# EAGLE schematic protestSignNode (EAGLE 6.6.0)

## Sheet 1 of 3
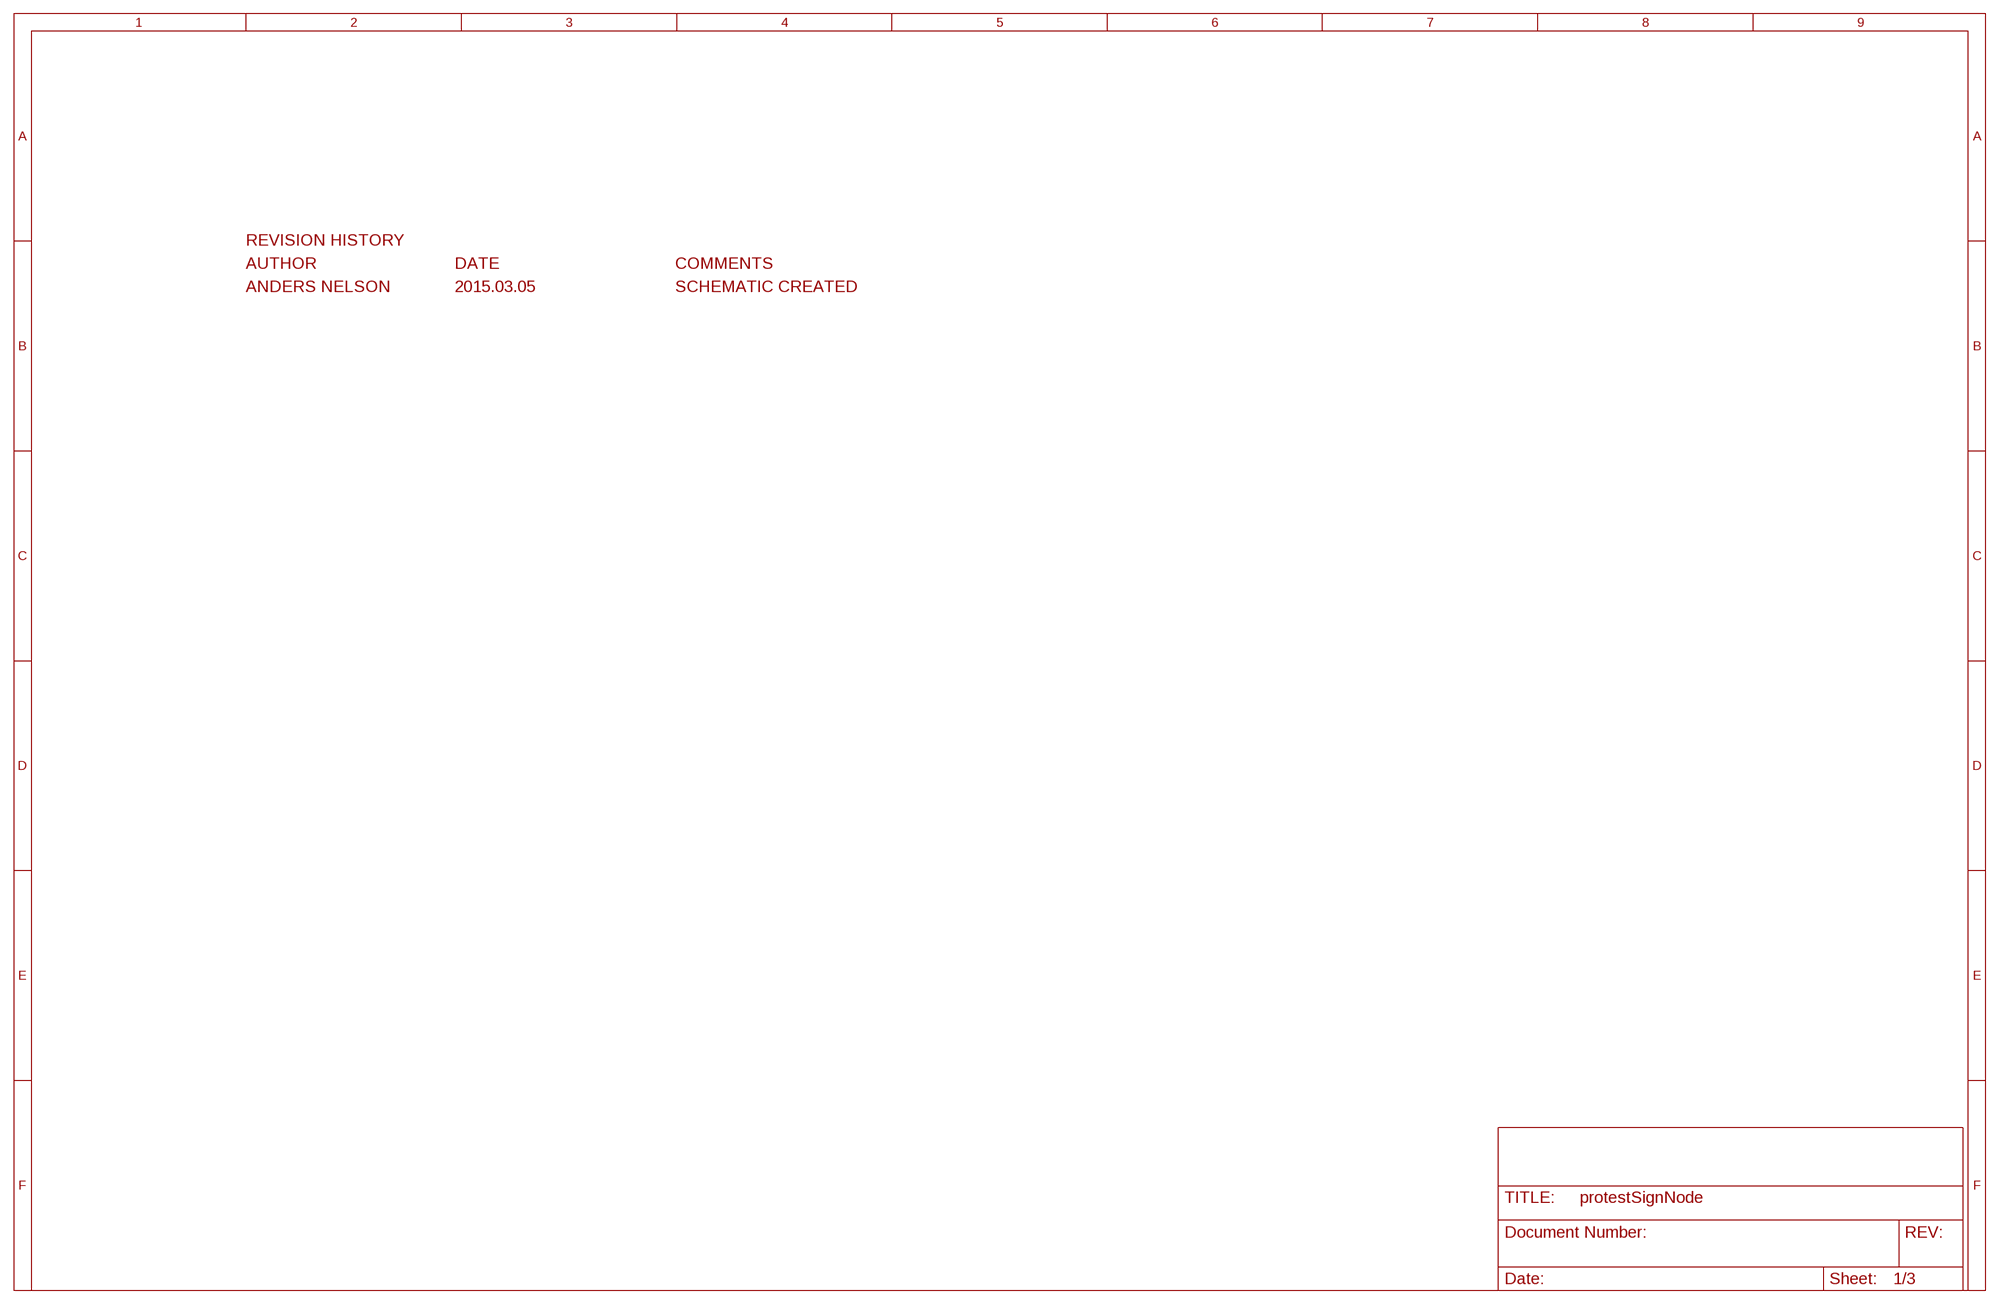
[diagram p0: schematic, sheet 1]

### Notes on the sheet
- REVISION HISTORY
- AUTHOR | DATE | COMMENTS
- ANDERS NELSON | 2015.03.05 | SCHEMATIC CREATED

## Sheet 2 of 3
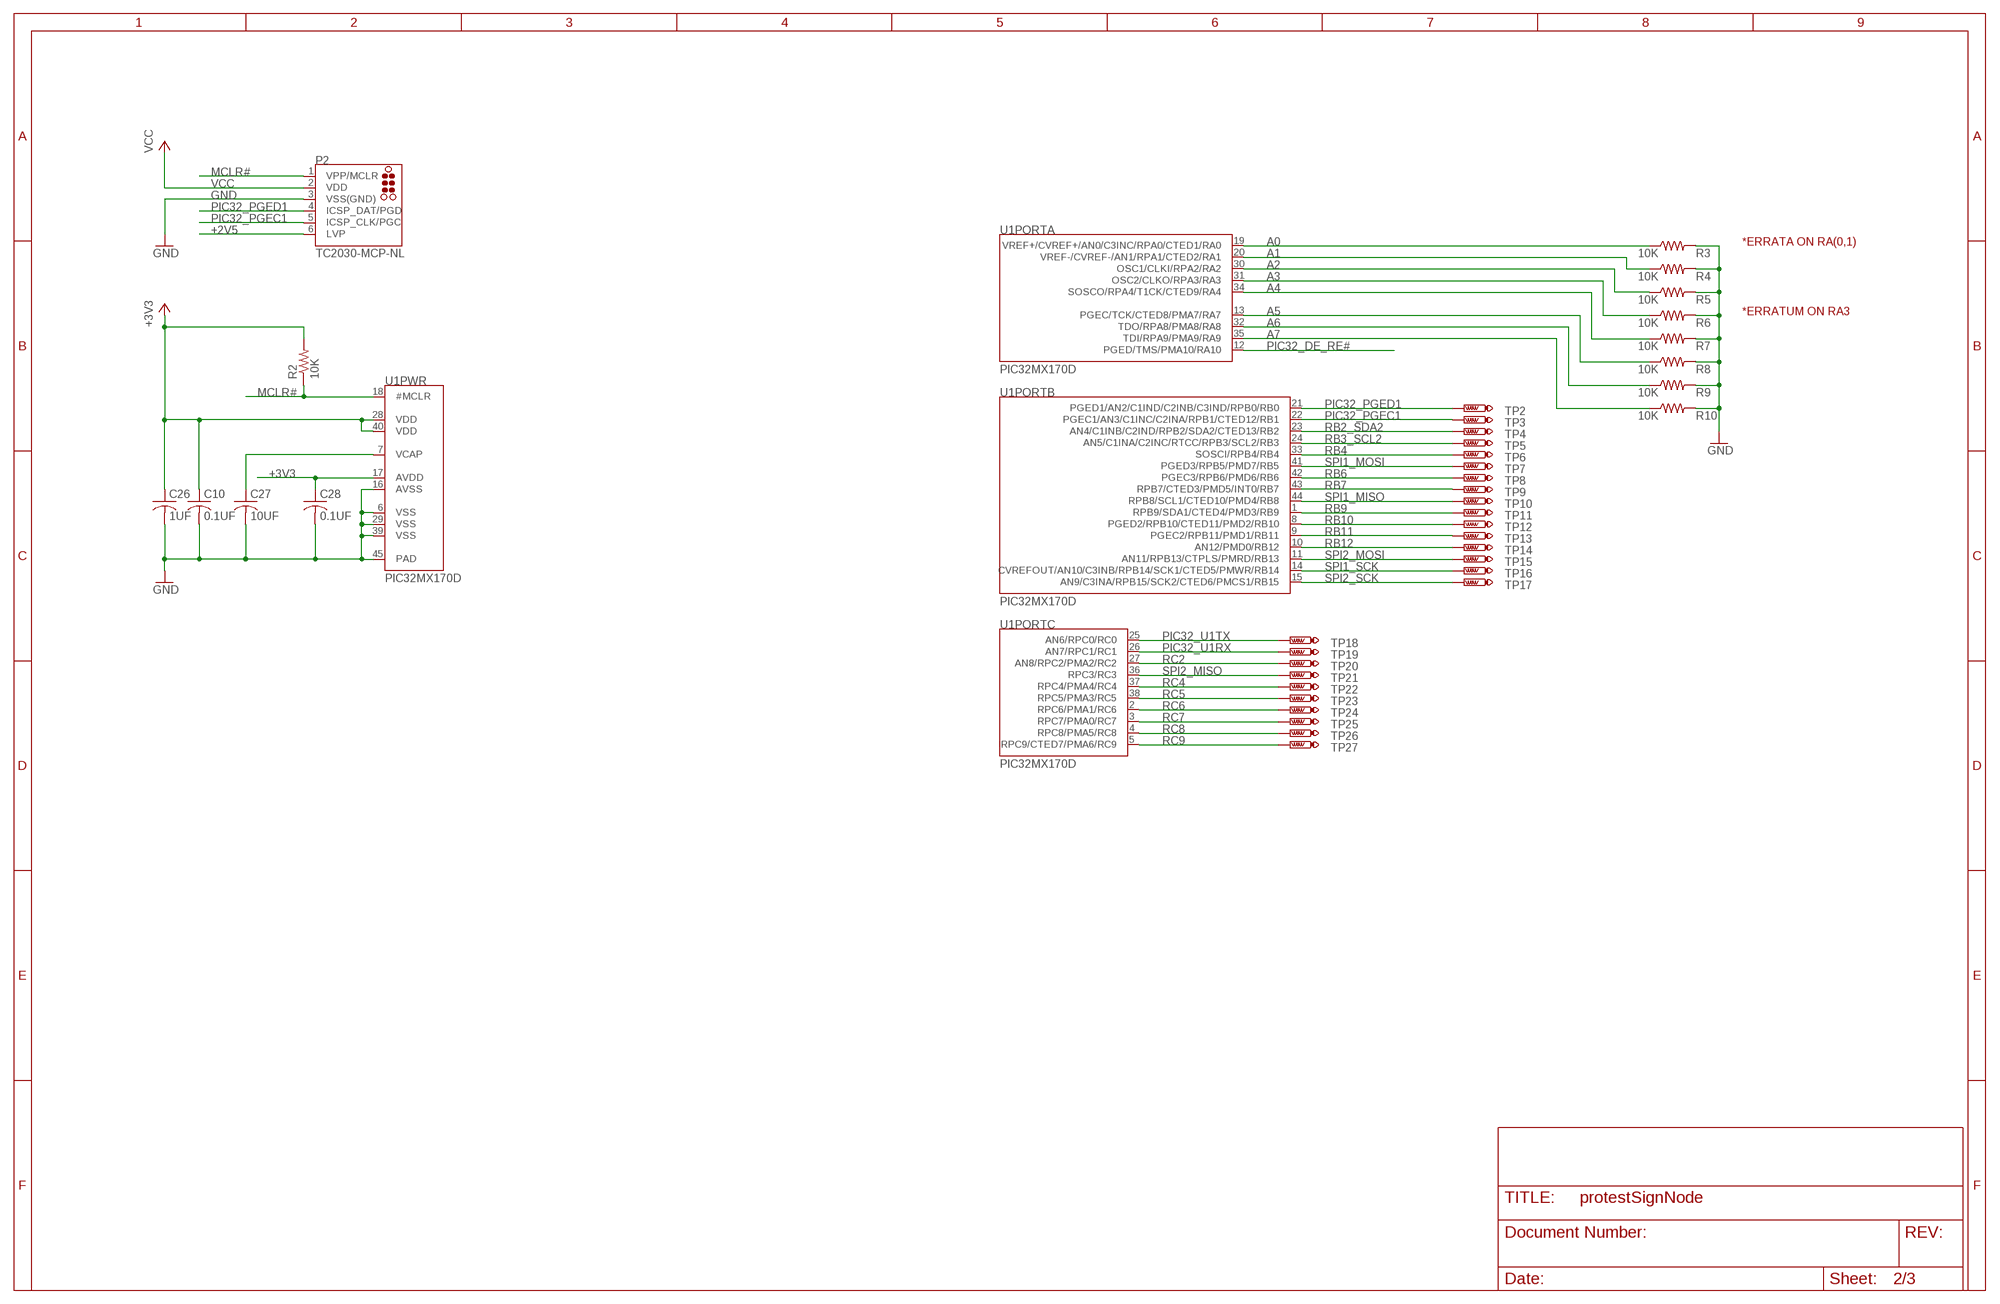
[diagram p1: schematic, sheet 2]

### Parts
C10  0.1UF  C-USC0402  [C0402]
C26  1UF  C-USC0402  [C0402]
C27  10UF  C-USC0603  [C0603]
C28  0.1UF  C-USC0402  [C0402]
P2  TC2030-MCP-NL  [TC2030-MCP-NL]
R2  10K  R-US_R0402  [R0402]
R3  10K  R-US_R0402  [R0402]
R4  10K  R-US_R0402  [R0402]
R5  10K  R-US_R0402  [R0402]
R6  10K  R-US_R0402  [R0402]
R7  10K  R-US_R0402  [R0402]
R8  10K  R-US_R0402  [R0402]
R9  10K  R-US_R0402  [R0402]
R10  10K  R-US_R0402  [R0402]
TP2  PTR1B1,27  [B1,27]
TP3  PTR1B1,27  [B1,27]
TP4  PTR1B1,27  [B1,27]
TP5  PTR1B1,27  [B1,27]
TP6  PTR1B1,27  [B1,27]
TP7  PTR1B1,27  [B1,27]
TP8  PTR1B1,27  [B1,27]
TP9  PTR1B1,27  [B1,27]
TP10  PTR1B1,27  [B1,27]
TP11  PTR1B1,27  [B1,27]
TP12  PTR1B1,27  [B1,27]
TP13  PTR1B1,27  [B1,27]
TP14  PTR1B1,27  [B1,27]
TP15  PTR1B1,27  [B1,27]
TP16  PTR1B1,27  [B1,27]
TP17  PTR1B1,27  [B1,27]
TP18  PTR1B1,27  [B1,27]
TP19  PTR1B1,27  [B1,27]
TP20  PTR1B1,27  [B1,27]
TP21  PTR1B1,27  [B1,27]
TP22  PTR1B1,27  [B1,27]
TP23  PTR1B1,27  [B1,27]
TP24  PTR1B1,27  [B1,27]
TP25  PTR1B1,27  [B1,27]
TP26  PTR1B1,27  [B1,27]
TP27  PTR1B1,27  [B1,27]
U1  PIC32MX170D  [VTLA44]

### Nets
+2V5: P2.6(LVP)
+3V3: C10.1 C26.1 C28.1 R2.2 U1.17(PWR:AVDD) U1.28(PWR:VDD) U1.40(PWR:VDD) ; also sheet 3
A0: R3.1 U1.19(PORTA:VREF+/CVREF+/AN0/C3INC/RPA0/CTED1/RA0)
A1: R4.1 U1.20(PORTA:VREF-/CVREF-/AN1/RPA1/CTED2/RA1)
A2: R5.1 U1.30(PORTA:OSC1/CLKI/RPA2/RA2)
A3: R6.1 U1.31(PORTA:OSC2/CLKO/RPA3/RA3)
A4: R7.1 U1.34(PORTA:SOSCO/RPA4/T1CK/CTED9/RA4)
A5: R8.1 U1.13(PORTA:PGEC/TCK/CTED8/PMA7/RA7)
A6: R9.1 U1.32(PORTA:TDO/RPA8/PMA8/RA8)
A7: R10.1 U1.35(PORTA:TDI/RPA9/PMA9/RA9)
GND: C10.2 C26.2 C27.2 C28.2 P2.3(VSS(GND)) R3.2 R4.2 R5.2 R6.2 R7.2 R8.2 R9.2 R10.2 U1.6(PWR:VSS) U1.16(PWR:AVSS) U1.29(PWR:VSS) U1.39(PWR:VSS) U1.45(PWR:PAD) ; also sheet 3
MCLR#: P2.1(VPP/MCLR) R2.1 U1.18(PWR:#MCLR)
N$1: C27.1 U1.7(PWR:VCAP)
PIC32_DE_RE#: U1.12(PORTA:PGED/TMS/PMA10/RA10) ; also sheet 3
PIC32_PGEC1: P2.5(ICSP_CLK/PGC) TP3.TP U1.22(PORTB:PGEC1/AN3/C1INC/C2INA/RPB1/CTED12/RB1)
PIC32_PGED1: P2.4(ICSP_DAT/PGD) TP2.TP U1.21(PORTB:PGED1/AN2/C1IND/C2INB/C3IND/RPB0/RB0)
PIC32_U1RX: TP19.TP U1.26(PORTC:AN7/RPC1/RC1) ; also sheet 3
PIC32_U1TX: TP18.TP U1.25(PORTC:AN6/RPC0/RC0) ; also sheet 3
RB2_SDA2: TP4.TP U1.23(PORTB:AN4/C1INB/C2IND/RPB2/SDA2/CTED13/RB2)
RB3_SCL2: TP5.TP U1.24(PORTB:AN5/C1INA/C2INC/RTCC/RPB3/SCL2/RB3)
RB4: TP6.TP U1.33(PORTB:SOSCI/RPB4/RB4)
RB6: TP8.TP U1.42(PORTB:PGEC3/RPB6/PMD6/RB6)
RB7: TP9.TP U1.43(PORTB:RPB7/CTED3/PMD5/INT0/RB7)
RB9: TP11.TP U1.1(PORTB:RPB9/SDA1/CTED4/PMD3/RB9)
RB10: TP12.TP U1.8(PORTB:PGED2/RPB10/CTED11/PMD2/RB10)
RB11: TP13.TP U1.9(PORTB:PGEC2/RPB11/PMD1/RB11)
RB12: TP14.TP U1.10(PORTB:AN12/PMD0/RB12)
RC2: TP20.TP U1.27(PORTC:AN8/RPC2/PMA2/RC2)
RC4: TP22.TP U1.37(PORTC:RPC4/PMA4/RC4)
RC5: TP23.TP U1.38(PORTC:RPC5/PMA3/RC5)
RC6: TP24.TP U1.2(PORTC:RPC6/PMA1/RC6)
RC7: TP25.TP U1.3(PORTC:RPC7/PMA0/RC7)
RC8: TP26.TP U1.4(PORTC:RPC8/PMA5/RC8)
RC9: TP27.TP U1.5(PORTC:RPC9/CTED7/PMA6/RC9)
SPI1_MISO: TP10.TP U1.44(PORTB:RPB8/SCL1/CTED10/PMD4/RB8)
SPI1_MOSI: TP7.TP U1.41(PORTB:PGED3/RPB5/PMD7/RB5)
SPI1_SCK: TP16.TP U1.14(PORTB:CVREFOUT/AN10/C3INB/RPB14/SCK1/CTED5/PMWR/RB14)
SPI2_MISO: TP21.TP U1.36(PORTC:RPC3/RC3)
SPI2_MOSI: TP15.TP U1.11(PORTB:AN11/RPB13/CTPLS/PMRD/RB13)
SPI2_SCK: TP17.TP U1.15(PORTB:AN9/C3INA/RPB15/SCK2/CTED6/PMCS1/RB15)
VCC: P2.2(VDD)

### Notes on the sheet
- *ERRATA ON RA(0,1)
- *ERRATUM ON RA3

## Sheet 3 of 3
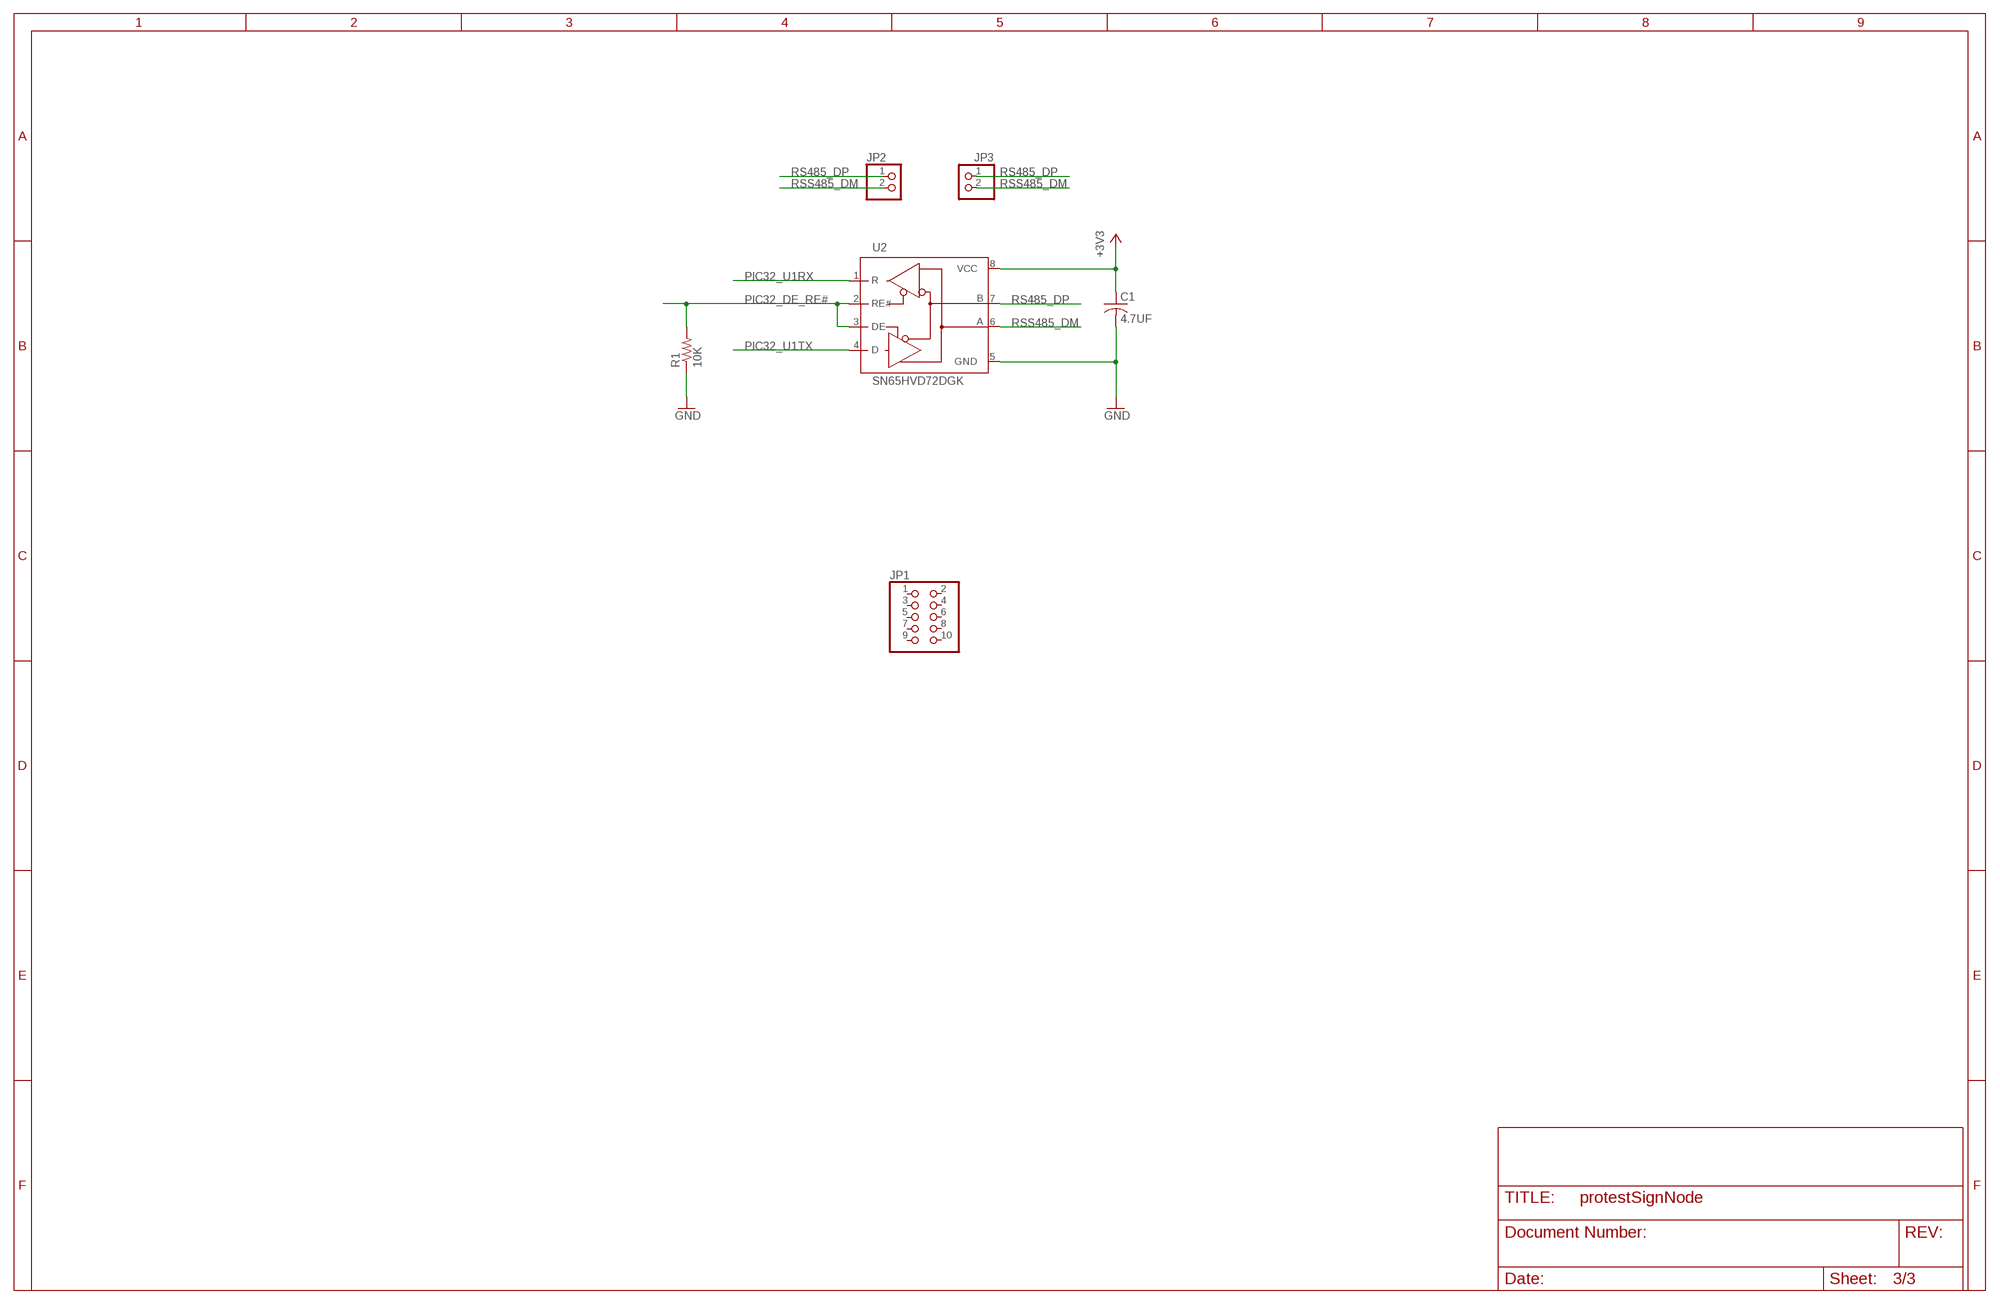
[diagram p2: schematic, sheet 3]

### Parts
C1  4.7UF  C-USC0603  [C0603]
JP1  PINHD-2X5  [2X05]
JP2  PINHD-1X2/90  [1X02/90]
JP3  PINHD-1X2/90  [1X02/90]
R1  10K  R-US_R0402  [R0402]
U2  SN65HVD72DGK  [DGK]

### Nets
+3V3: C1.1 U2.8(VCC) ; also sheet 2
GND: C1.2 R1.1 U2.5(GND) ; also sheet 2
PIC32_DE_RE#: R1.2 U2.2(RE#) U2.3(DE) ; also sheet 2
PIC32_U1RX: U2.1(R) ; also sheet 2
PIC32_U1TX: U2.4(D) ; also sheet 2
RS485_DP: JP2.1 JP3.1 U2.7(B)
RSS485_DM: JP2.2 JP3.2 U2.6(A)
Unconnected: JP1.1 JP1.2 JP1.3 JP1.4 JP1.5 JP1.6 JP1.7 JP1.8 JP1.9 JP1.10

## Library data of the parts
C1 C10 C26-C28 = rcl:C-US: CAPACITOR, American symbol
JP1 = pinhead:PINHD-2X5: PIN HEADER
JP2 JP3 = pinhead:PINHD-1X2: PIN HEADER
P2 = raveGearControl:TC2030: TAG-CONNECT ISP Connector Manufacturer: Tag-Connect <www.tag-connect.com> Cable for easy In-Circuit PCB Programming. Designed for Microchip ICD2, suitable for many others. Two variants - one "with legs" (for hads-free fit on PCB) and another "without legs" for quick programming. PAD Description 1 MCLR/Vpp 2 Vdd 3 GND 4 PGD (ISPDAT) 5 PGC (ISPCLK) 6 nc (used for LVP) ©2009 ROFA.cz
R1-R10 = rcl:R-US_: RESISTOR, American symbol
TP2-TP27 = testpad:PTR1: TEST PIN
U1 = raveGear5:PIC32MX1*D
U2 = protestSignNode:SN65HVD7*